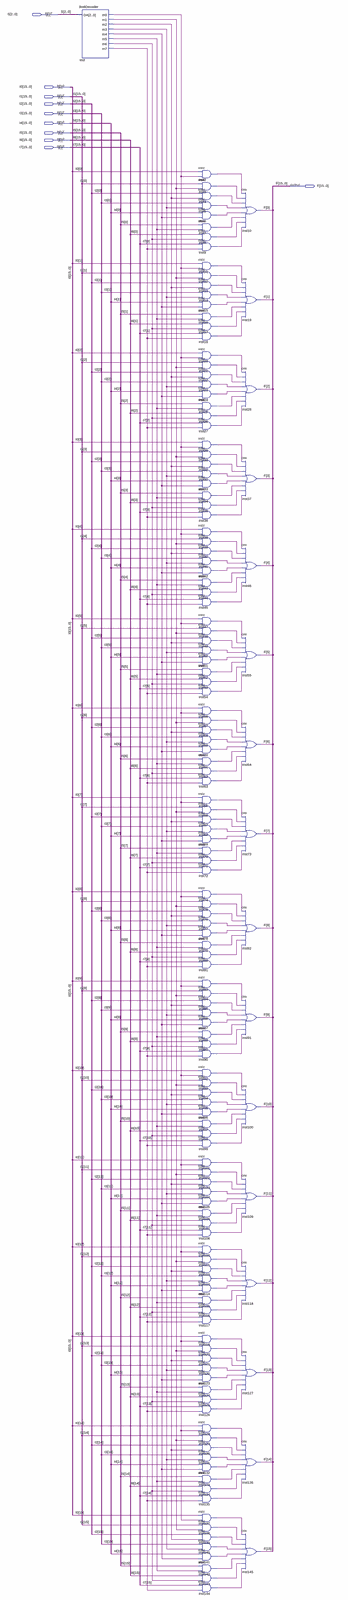
[diagram p0: schematic sheet, whole]
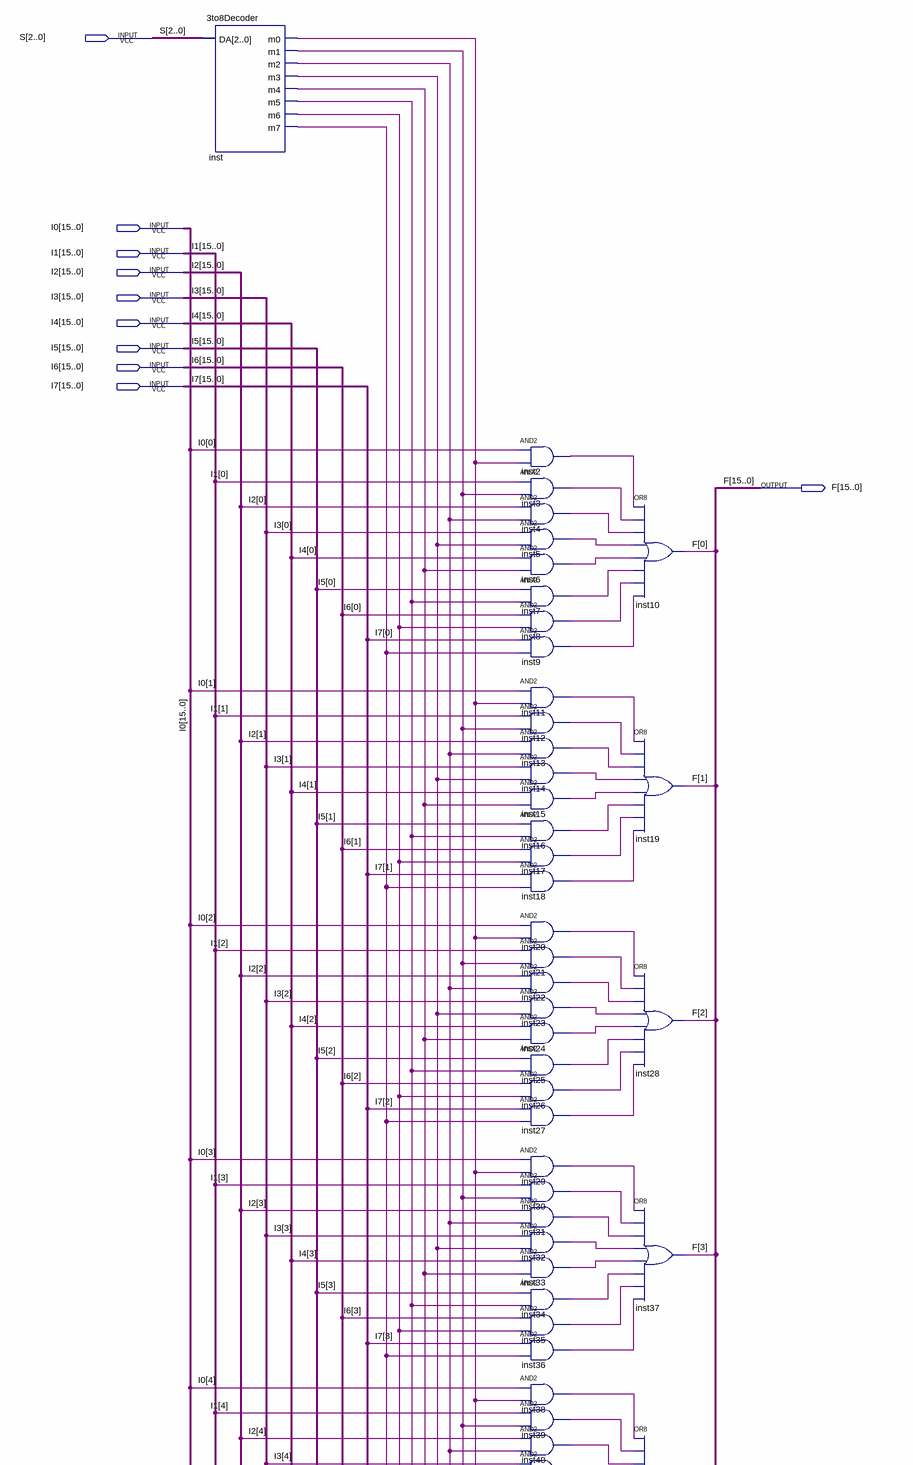
[diagram p1: schematic sheet, upper part]
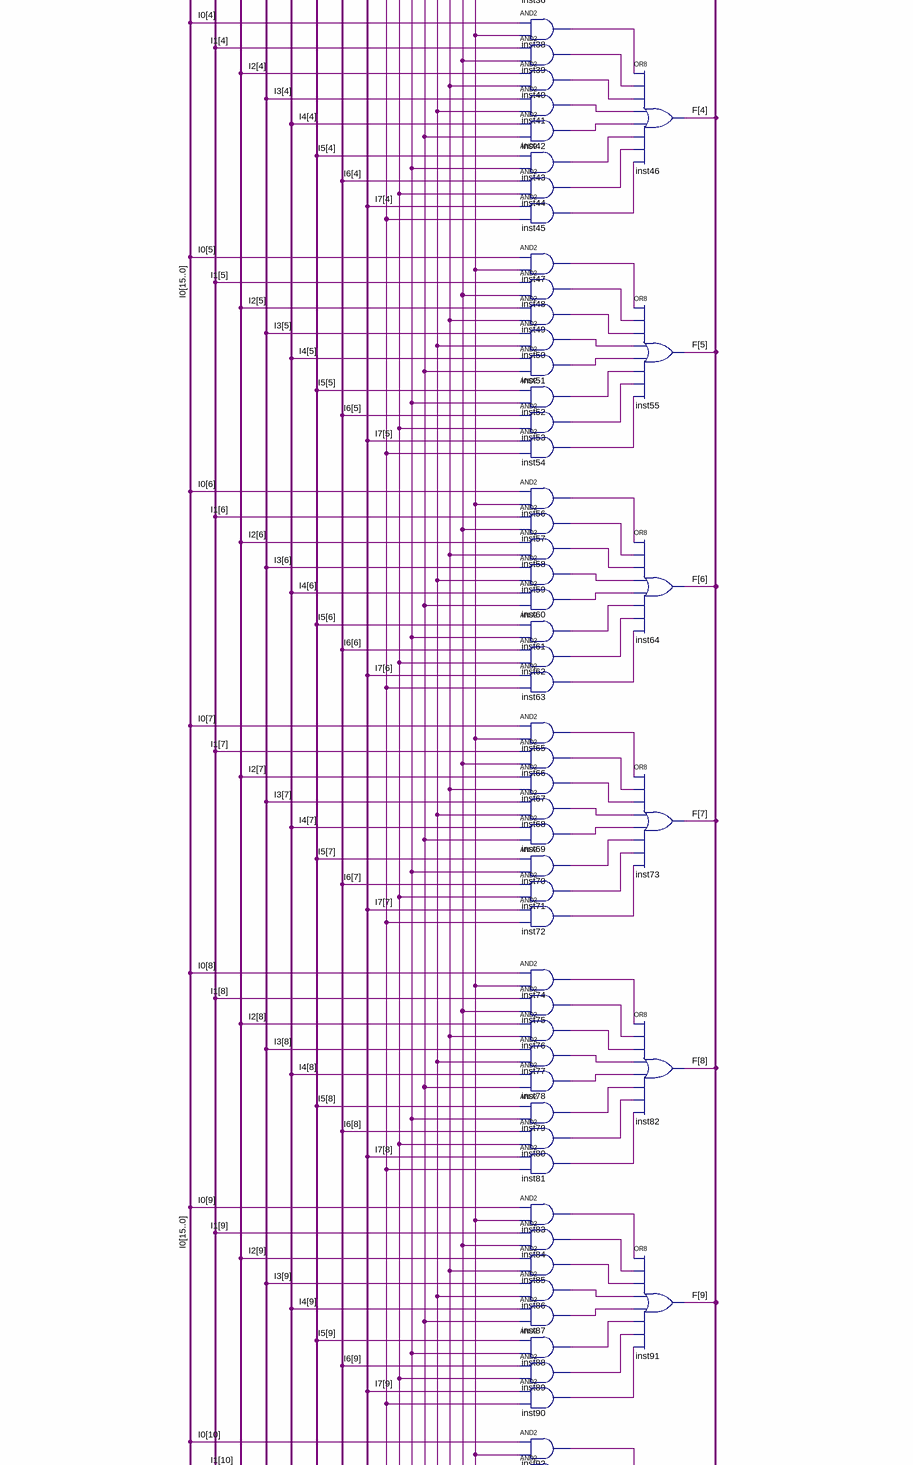
[diagram p2: schematic sheet, middle part]
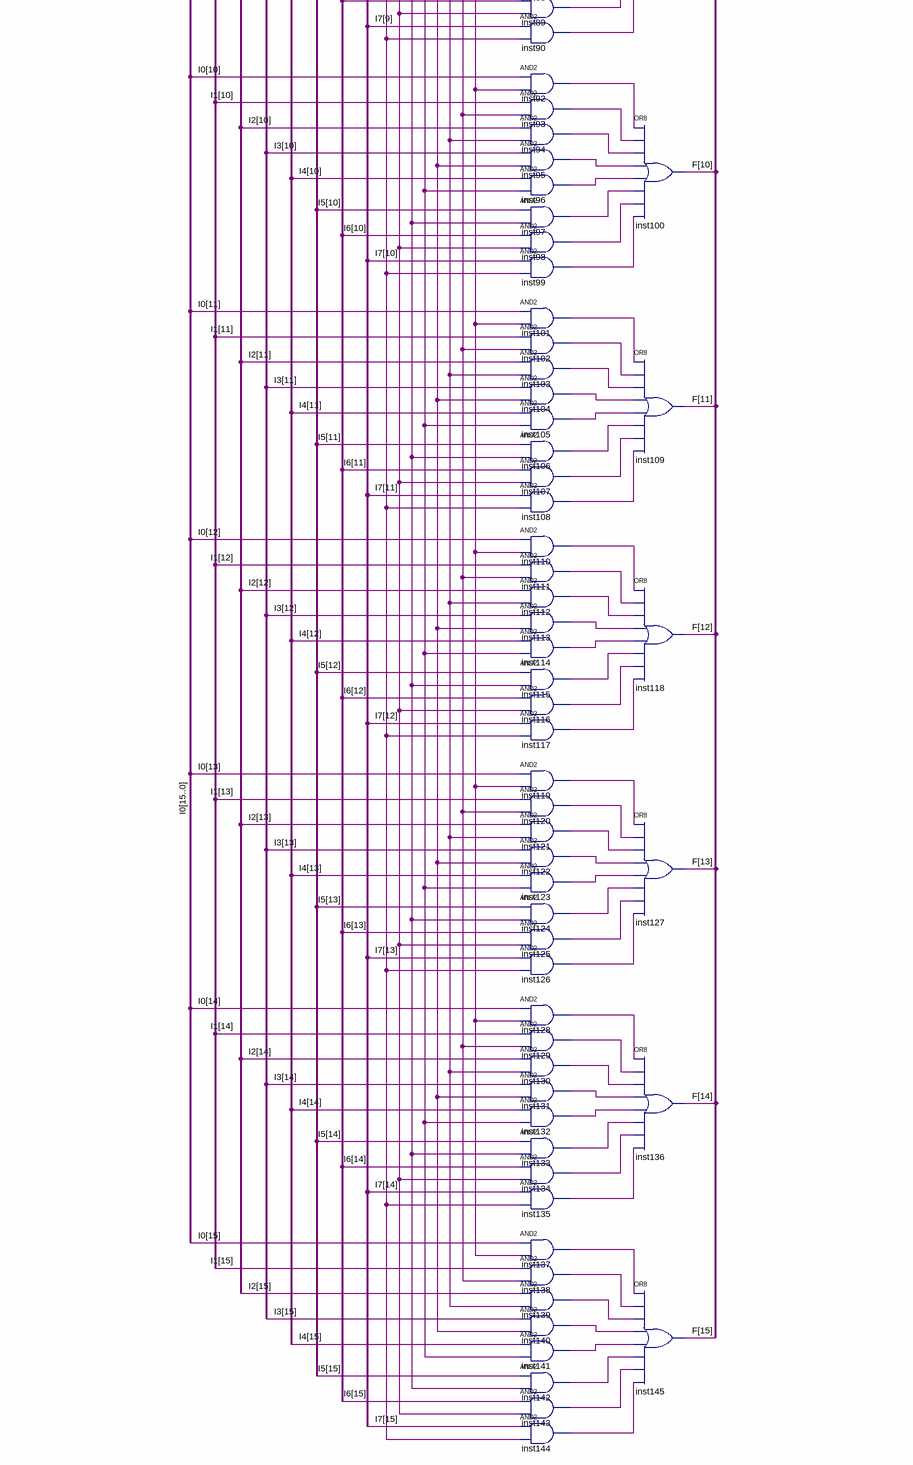
[diagram p3: schematic sheet, lower part]
// Quartus schematic 8by16Mux.bdf as structural Verilog: 145 symbols, 10 pins
module \8by16Mux  (
  input  [2:0] S,
  input  [15:0] I0,
  input  [15:0] I1,
  input  [15:0] I2,
  input  [15:0] I3,
  input  [15:0] I4,
  input  [15:0] I5,
  input  [15:0] I6,
  input  [15:0] I7,
  output [15:0] F
);

  wire inst2_out, inst3_out, inst4_out, inst5_out, inst6_out, inst7_out, inst8_out, inst9_out, inst11_out,
       inst12_out, inst13_out, inst14_out, inst15_out, inst16_out, inst17_out, inst18_out, inst20_out,
       inst21_out, inst22_out, inst23_out, inst24_out, inst25_out, inst26_out, inst27_out, inst29_out,
       inst30_out, inst31_out, inst32_out, inst33_out, inst34_out, inst35_out, inst36_out, inst38_out,
       inst39_out, inst40_out, inst41_out, inst42_out, inst43_out, inst44_out, inst45_out, inst47_out,
       inst48_out, inst49_out, inst50_out, inst51_out, inst52_out, inst53_out, inst54_out, inst56_out,
       inst57_out, inst58_out, inst59_out, inst60_out, inst61_out, inst62_out, inst63_out, inst65_out,
       inst66_out, inst67_out, inst68_out, inst69_out, inst70_out, inst71_out, inst72_out, inst74_out,
       inst75_out, inst76_out, inst77_out, inst78_out, inst79_out, inst80_out, inst81_out, inst83_out,
       inst84_out, inst85_out, inst86_out, inst87_out, inst88_out, inst89_out, inst90_out, inst92_out,
       inst93_out, inst94_out, inst95_out, inst96_out, inst97_out, inst98_out, inst99_out, inst101_out,
       inst102_out, inst103_out, inst104_out, inst105_out, inst106_out, inst107_out, inst108_out,
       inst110_out, inst111_out, inst112_out, inst113_out, inst114_out, inst115_out, inst116_out,
       inst117_out, inst119_out, inst120_out, inst121_out, inst122_out, inst123_out, inst124_out,
       inst125_out, inst126_out, inst128_out, inst129_out, inst130_out, inst131_out, inst132_out,
       inst133_out, inst134_out, inst135_out, inst137_out, inst138_out, inst139_out, inst140_out,
       inst141_out, inst142_out, inst143_out, inst144_out, inst_m0, inst_m1, inst_m2, inst_m3, inst_m4,
       inst_m5, inst_m6, inst_m7;

  \3to8Decoder  inst (
    .DA(S), .m0(inst_m0), .m1(inst_m1), .m2(inst_m2), .m3(inst_m3), .m4(inst_m4), .m5(inst_m5), .m6(inst_m6),
    .m7(inst_m7));
  and inst2 (inst2_out, I0[0], inst_m0);
  and inst3 (inst3_out, I1[0], inst_m1);
  and inst4 (inst4_out, I2[0], inst_m2);
  and inst5 (inst5_out, I3[0], inst_m3);
  and inst6 (inst6_out, I4[0], inst_m4);
  and inst7 (inst7_out, I5[0], inst_m5);
  and inst8 (inst8_out, I6[0], inst_m6);
  and inst9 (inst9_out, I7[0], inst_m7);
  and inst11 (inst11_out, I0[1], inst_m0);
  and inst12 (inst12_out, I1[1], inst_m1);
  and inst13 (inst13_out, I2[1], inst_m2);
  and inst14 (inst14_out, I3[1], inst_m3);
  and inst15 (inst15_out, I4[1], inst_m4);
  and inst16 (inst16_out, I5[1], inst_m5);
  and inst17 (inst17_out, I6[1], inst_m6);
  and inst18 (inst18_out, I7[1], inst_m7);
  and inst20 (inst20_out, I0[2], inst_m0);
  and inst21 (inst21_out, I1[2], inst_m1);
  and inst22 (inst22_out, I2[2], inst_m2);
  and inst23 (inst23_out, I3[2], inst_m3);
  and inst24 (inst24_out, I4[2], inst_m4);
  and inst25 (inst25_out, I5[2], inst_m5);
  and inst26 (inst26_out, I6[2], inst_m6);
  and inst27 (inst27_out, I7[2], inst_m7);
  and inst29 (inst29_out, I0[3], inst_m0);
  and inst30 (inst30_out, I1[3], inst_m1);
  and inst31 (inst31_out, I2[3], inst_m2);
  and inst32 (inst32_out, I3[3], inst_m3);
  and inst33 (inst33_out, I4[3], inst_m4);
  and inst34 (inst34_out, I5[3], inst_m5);
  and inst35 (inst35_out, I6[3], inst_m6);
  and inst36 (inst36_out, I7[3], inst_m7);
  and inst38 (inst38_out, I0[4], inst_m0);
  and inst39 (inst39_out, I1[4], inst_m1);
  and inst40 (inst40_out, I2[4], inst_m2);
  and inst41 (inst41_out, I3[4], inst_m3);
  and inst42 (inst42_out, I4[4], inst_m4);
  and inst43 (inst43_out, I5[4], inst_m5);
  and inst44 (inst44_out, I6[4], inst_m6);
  and inst45 (inst45_out, I7[4], inst_m7);
  and inst47 (inst47_out, I0[5], inst_m0);
  and inst48 (inst48_out, I1[5], inst_m1);
  and inst49 (inst49_out, I2[5], inst_m2);
  and inst50 (inst50_out, I3[5], inst_m3);
  and inst51 (inst51_out, I4[5], inst_m4);
  and inst52 (inst52_out, I5[5], inst_m5);
  and inst53 (inst53_out, I6[5], inst_m6);
  and inst54 (inst54_out, I7[5], inst_m7);
  and inst56 (inst56_out, I0[6], inst_m0);
  and inst57 (inst57_out, I1[6], inst_m1);
  and inst58 (inst58_out, I2[6], inst_m2);
  and inst59 (inst59_out, I3[6], inst_m3);
  and inst60 (inst60_out, I4[6], inst_m4);
  and inst61 (inst61_out, I5[6], inst_m5);
  and inst62 (inst62_out, I6[6], inst_m6);
  and inst63 (inst63_out, I7[6], inst_m7);
  and inst65 (inst65_out, I0[7], inst_m0);
  and inst66 (inst66_out, I1[7], inst_m1);
  and inst67 (inst67_out, I2[7], inst_m2);
  and inst68 (inst68_out, I3[7], inst_m3);
  and inst69 (inst69_out, I4[7], inst_m4);
  and inst70 (inst70_out, I5[7], inst_m5);
  and inst71 (inst71_out, I6[7], inst_m6);
  and inst72 (inst72_out, I7[7], inst_m7);
  and inst74 (inst74_out, I0[8], inst_m0);
  and inst75 (inst75_out, I1[8], inst_m1);
  and inst76 (inst76_out, I2[8], inst_m2);
  and inst77 (inst77_out, I3[8], inst_m3);
  and inst78 (inst78_out, I4[8], inst_m4);
  and inst79 (inst79_out, I5[8], inst_m5);
  and inst80 (inst80_out, I6[8], inst_m6);
  and inst81 (inst81_out, I7[8], inst_m7);
  and inst83 (inst83_out, I0[9], inst_m0);
  and inst84 (inst84_out, I1[9], inst_m1);
  and inst85 (inst85_out, I2[9], inst_m2);
  and inst86 (inst86_out, I3[9], inst_m3);
  and inst87 (inst87_out, I4[9], inst_m4);
  and inst88 (inst88_out, I5[9], inst_m5);
  and inst89 (inst89_out, I6[9], inst_m6);
  and inst90 (inst90_out, I7[9], inst_m7);
  and inst92 (inst92_out, I0[10], inst_m0);
  and inst93 (inst93_out, I1[10], inst_m1);
  and inst94 (inst94_out, I2[10], inst_m2);
  and inst95 (inst95_out, I3[10], inst_m3);
  and inst96 (inst96_out, I4[10], inst_m4);
  and inst97 (inst97_out, I5[10], inst_m5);
  and inst98 (inst98_out, I6[10], inst_m6);
  and inst99 (inst99_out, I7[10], inst_m7);
  and inst101 (inst101_out, I0[11], inst_m0);
  and inst102 (inst102_out, I1[11], inst_m1);
  and inst103 (inst103_out, I2[11], inst_m2);
  and inst104 (inst104_out, I3[11], inst_m3);
  and inst105 (inst105_out, I4[11], inst_m4);
  and inst106 (inst106_out, I5[11], inst_m5);
  and inst107 (inst107_out, I6[11], inst_m6);
  and inst108 (inst108_out, I7[11], inst_m7);
  and inst110 (inst110_out, I0[12], inst_m0);
  and inst111 (inst111_out, I1[12], inst_m1);
  and inst112 (inst112_out, I2[12], inst_m2);
  and inst113 (inst113_out, I3[12], inst_m3);
  and inst114 (inst114_out, I4[12], inst_m4);
  and inst115 (inst115_out, I5[12], inst_m5);
  and inst116 (inst116_out, I6[12], inst_m6);
  and inst117 (inst117_out, I7[12], inst_m7);
  and inst119 (inst119_out, I0[13], inst_m0);
  and inst120 (inst120_out, I1[13], inst_m1);
  and inst121 (inst121_out, I2[13], inst_m2);
  and inst122 (inst122_out, I3[13], inst_m3);
  and inst123 (inst123_out, I4[13], inst_m4);
  and inst124 (inst124_out, I5[13], inst_m5);
  and inst125 (inst125_out, I6[13], inst_m6);
  and inst126 (inst126_out, I7[13], inst_m7);
  and inst128 (inst128_out, I0[14], inst_m0);
  and inst129 (inst129_out, I1[14], inst_m1);
  and inst130 (inst130_out, I2[14], inst_m2);
  and inst131 (inst131_out, I3[14], inst_m3);
  and inst132 (inst132_out, I4[14], inst_m4);
  and inst133 (inst133_out, I5[14], inst_m5);
  and inst134 (inst134_out, I6[14], inst_m6);
  and inst135 (inst135_out, I7[14], inst_m7);
  and inst137 (inst137_out, I0[15], inst_m0);
  and inst138 (inst138_out, I1[15], inst_m1);
  and inst139 (inst139_out, I2[15], inst_m2);
  and inst140 (inst140_out, I3[15], inst_m3);
  and inst141 (inst141_out, I4[15], inst_m4);
  and inst142 (inst142_out, I5[15], inst_m5);
  and inst143 (inst143_out, I6[15], inst_m6);
  and inst144 (inst144_out, I7[15], inst_m7);
  or inst10 (F[0], inst2_out, inst3_out, inst4_out, inst5_out, inst6_out, inst7_out, inst8_out, inst9_out);
  or inst19 (F[1], inst11_out, inst12_out, inst13_out, inst14_out, inst15_out, inst16_out, inst17_out, inst18_out);
  or inst28 (F[2], inst20_out, inst21_out, inst22_out, inst23_out, inst24_out, inst25_out, inst26_out, inst27_out);
  or inst37 (F[3], inst29_out, inst30_out, inst31_out, inst32_out, inst33_out, inst34_out, inst35_out, inst36_out);
  or inst46 (F[4], inst38_out, inst39_out, inst40_out, inst41_out, inst42_out, inst43_out, inst44_out, inst45_out);
  or inst55 (F[5], inst47_out, inst48_out, inst49_out, inst50_out, inst51_out, inst52_out, inst53_out, inst54_out);
  or inst64 (F[6], inst56_out, inst57_out, inst58_out, inst59_out, inst60_out, inst61_out, inst62_out, inst63_out);
  or inst73 (F[7], inst65_out, inst66_out, inst67_out, inst68_out, inst69_out, inst70_out, inst71_out, inst72_out);
  or inst82 (F[8], inst74_out, inst75_out, inst76_out, inst77_out, inst78_out, inst79_out, inst80_out, inst81_out);
  or inst91 (F[9], inst83_out, inst84_out, inst85_out, inst86_out, inst87_out, inst88_out, inst89_out, inst90_out);
  or inst100 (F[10], inst92_out, inst93_out, inst94_out, inst95_out, inst96_out, inst97_out, inst98_out, inst99_out);
  or inst109 (F[11], inst101_out, inst102_out, inst103_out, inst104_out, inst105_out, inst106_out, inst107_out, inst108_out);
  or inst118 (F[12], inst110_out, inst111_out, inst112_out, inst113_out, inst114_out, inst115_out, inst116_out, inst117_out);
  or inst127 (F[13], inst119_out, inst120_out, inst121_out, inst122_out, inst123_out, inst124_out, inst125_out, inst126_out);
  or inst136 (F[14], inst128_out, inst129_out, inst130_out, inst131_out, inst132_out, inst133_out, inst134_out, inst135_out);
  or inst145 (F[15], inst137_out, inst138_out, inst139_out, inst140_out, inst141_out, inst142_out, inst143_out, inst144_out);
endmodule
